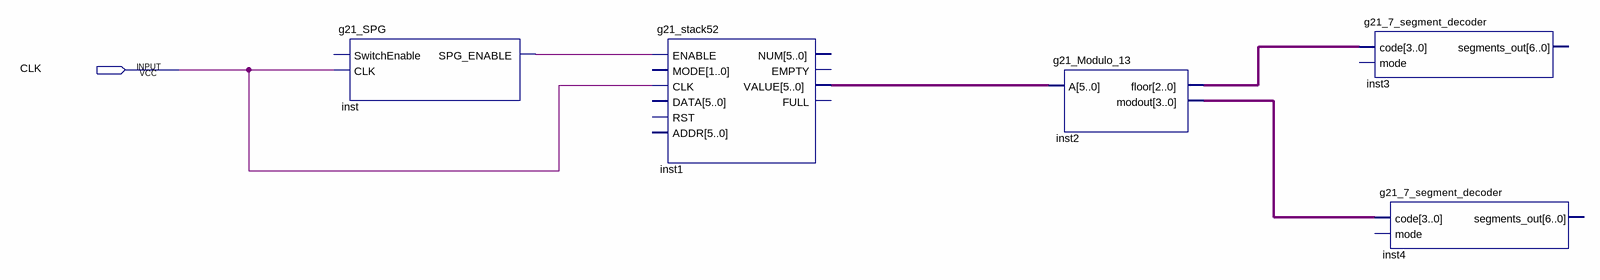
[diagram p0: schematic sheet]
// Quartus schematic g21_test-bed.bdf as structural Verilog: 5 symbols, 1 pins
module \g21_test-bed  (
  input  CLK
);

  wire inst_spg_enable;
  wire [3:0] inst2_floor, inst2_modout;
  wire [5:0] inst1_value;

  g21_SPG inst (.CLK(CLK), .SPG_ENABLE(inst_spg_enable));  // open: SwitchEnable
  g21_stack52 inst1 (
    .ENABLE(inst_spg_enable), .CLK(CLK), .VALUE(inst1_value));  // open: MODE, DATA, RST, ADDR, NUM, EMPTY, FULL
  g21_Modulo_13 inst2 (.A(inst1_value), .floor(inst2_floor), .modout(inst2_modout));
  g21_7_segment_decoder inst3 (.code(inst2_floor));  // open: mode, segments_out
  g21_7_segment_decoder inst4 (.code(inst2_modout));  // open: mode, segments_out
endmodule
